# EAGLE design Schmetic (EAGLE 9.0.1)
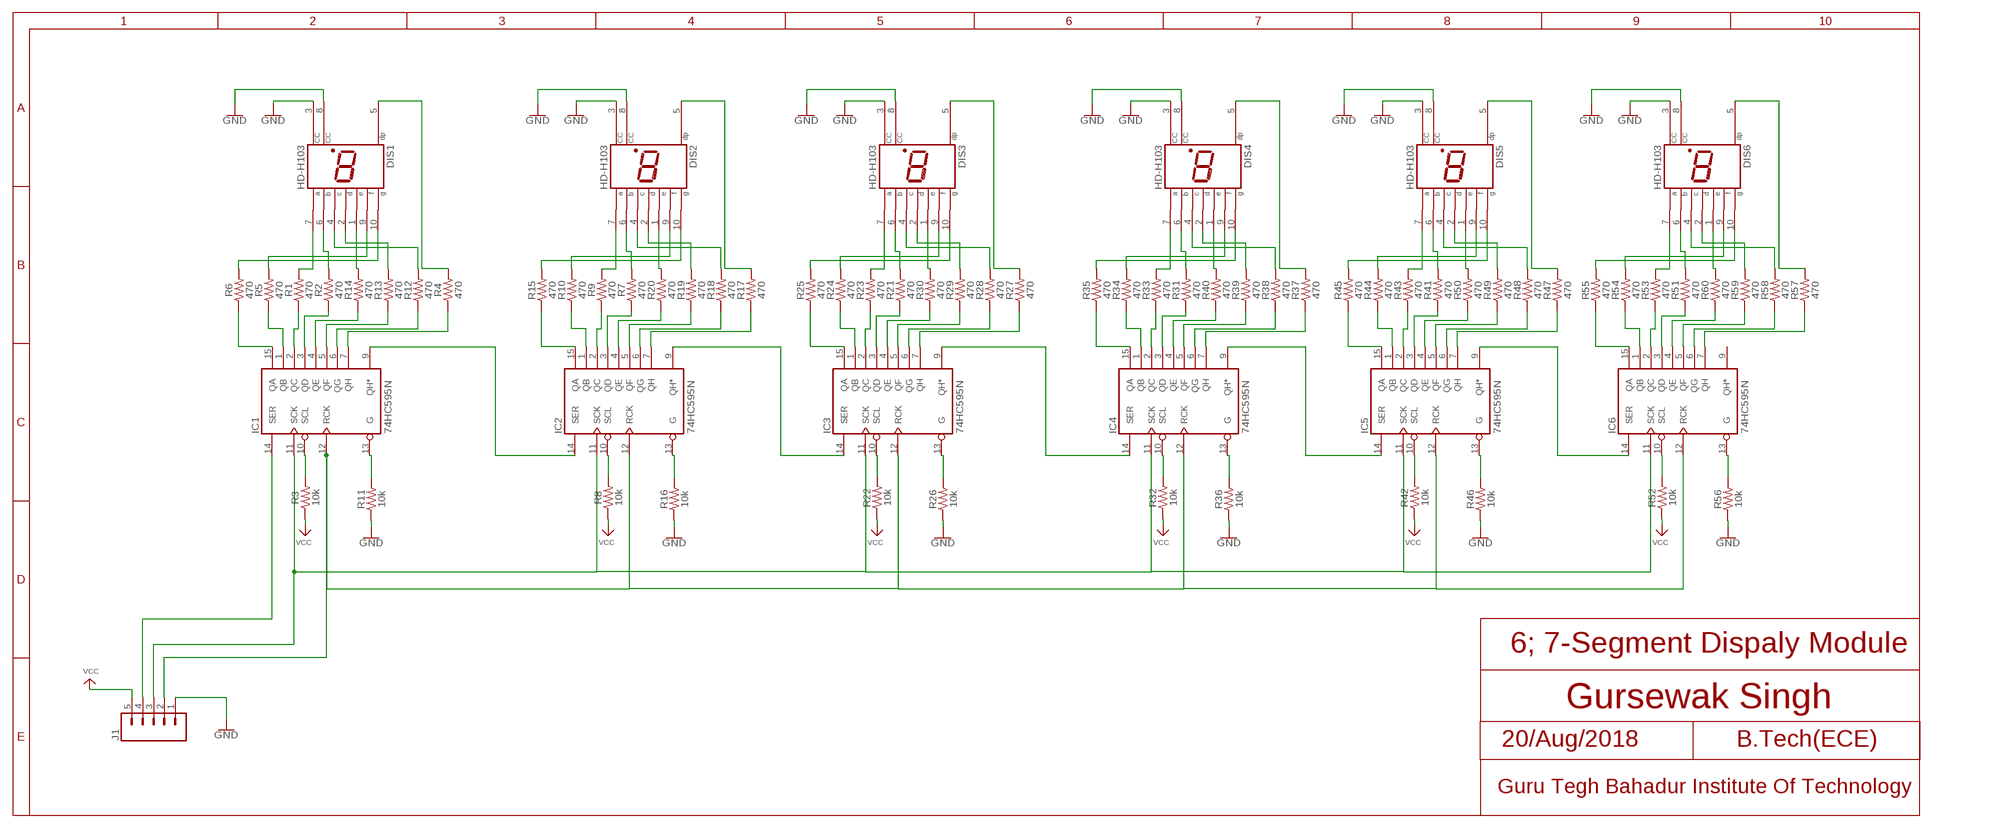
[diagram p0: schematic, sheet 1]

## Parts
DIS1  HD-H103  [HDSP-M]
DIS2  HD-H103  [HDSP-M]
DIS3  HD-H103  [HDSP-M]
DIS4  HD-H103  [HDSP-M]
DIS5  HD-H103  [HDSP-M]
DIS6  HD-H103  [HDSP-M]
IC1  74HC595N  [DIL16]
IC2  74HC595N  [DIL16]
IC3  74HC595N  [DIL16]
IC4  74HC595N  [DIL16]
IC5  74HC595N  [DIL16]
IC6  74HC595N  [DIL16]
J1  CONN_05LOCK_LONGPADS  [1X05_LOCK_LONGPADS]
R1  470  1KOHM-HORIZ-1/4W-1%  [AXIAL-0.3]
R2  470  1KOHM-HORIZ-1/4W-1%  [AXIAL-0.3]
R3  10k  1KOHM-HORIZ-1/4W-1%  [AXIAL-0.3]
R4  470  1KOHM-HORIZ-1/4W-1%  [AXIAL-0.3]
R5  470  1KOHM-HORIZ-1/4W-1%  [AXIAL-0.3]
R6  470  1KOHM-HORIZ-1/4W-1%  [AXIAL-0.3]
R7  470  1KOHM-HORIZ-1/4W-1%  [AXIAL-0.3]
R8  10k  1KOHM-HORIZ-1/4W-1%  [AXIAL-0.3]
R9  470  1KOHM-HORIZ-1/4W-1%  [AXIAL-0.3]
R10  470  1KOHM-HORIZ-1/4W-1%  [AXIAL-0.3]
R11  10k  1KOHM-HORIZ-1/4W-1%  [AXIAL-0.3]
R12  470  1KOHM-HORIZ-1/4W-1%  [AXIAL-0.3]
R13  470  1KOHM-HORIZ-1/4W-1%  [AXIAL-0.3]
R14  470  1KOHM-HORIZ-1/4W-1%  [AXIAL-0.3]
R15  470  1KOHM-HORIZ-1/4W-1%  [AXIAL-0.3]
R16  10k  1KOHM-HORIZ-1/4W-1%  [AXIAL-0.3]
R17  470  1KOHM-HORIZ-1/4W-1%  [AXIAL-0.3]
R18  470  1KOHM-HORIZ-1/4W-1%  [AXIAL-0.3]
R19  470  1KOHM-HORIZ-1/4W-1%  [AXIAL-0.3]
R20  470  1KOHM-HORIZ-1/4W-1%  [AXIAL-0.3]
R21  470  1KOHM-HORIZ-1/4W-1%  [AXIAL-0.3]
R22  10k  1KOHM-HORIZ-1/4W-1%  [AXIAL-0.3]
R23  470  1KOHM-HORIZ-1/4W-1%  [AXIAL-0.3]
R24  470  1KOHM-HORIZ-1/4W-1%  [AXIAL-0.3]
R25  470  1KOHM-HORIZ-1/4W-1%  [AXIAL-0.3]
R26  10k  1KOHM-HORIZ-1/4W-1%  [AXIAL-0.3]
R27  470  1KOHM-HORIZ-1/4W-1%  [AXIAL-0.3]
R28  470  1KOHM-HORIZ-1/4W-1%  [AXIAL-0.3]
R29  470  1KOHM-HORIZ-1/4W-1%  [AXIAL-0.3]
R30  470  1KOHM-HORIZ-1/4W-1%  [AXIAL-0.3]
R31  470  1KOHM-HORIZ-1/4W-1%  [AXIAL-0.3]
R32  10k  1KOHM-HORIZ-1/4W-1%  [AXIAL-0.3]
R33  470  1KOHM-HORIZ-1/4W-1%  [AXIAL-0.3]
R34  470  1KOHM-HORIZ-1/4W-1%  [AXIAL-0.3]
R35  470  1KOHM-HORIZ-1/4W-1%  [AXIAL-0.3]
R36  10k  1KOHM-HORIZ-1/4W-1%  [AXIAL-0.3]
R37  470  1KOHM-HORIZ-1/4W-1%  [AXIAL-0.3]
R38  470  1KOHM-HORIZ-1/4W-1%  [AXIAL-0.3]
R39  470  1KOHM-HORIZ-1/4W-1%  [AXIAL-0.3]
R40  470  1KOHM-HORIZ-1/4W-1%  [AXIAL-0.3]
R41  470  1KOHM-HORIZ-1/4W-1%  [AXIAL-0.3]
R42  10k  1KOHM-HORIZ-1/4W-1%  [AXIAL-0.3]
R43  470  1KOHM-HORIZ-1/4W-1%  [AXIAL-0.3]
R44  470  1KOHM-HORIZ-1/4W-1%  [AXIAL-0.3]
R45  470  1KOHM-HORIZ-1/4W-1%  [AXIAL-0.3]
R46  10k  1KOHM-HORIZ-1/4W-1%  [AXIAL-0.3]
R47  470  1KOHM-HORIZ-1/4W-1%  [AXIAL-0.3]
R48  470  1KOHM-HORIZ-1/4W-1%  [AXIAL-0.3]
R49  470  1KOHM-HORIZ-1/4W-1%  [AXIAL-0.3]
R50  470  1KOHM-HORIZ-1/4W-1%  [AXIAL-0.3]
R51  470  1KOHM-HORIZ-1/4W-1%  [AXIAL-0.3]
R52  10k  1KOHM-HORIZ-1/4W-1%  [AXIAL-0.3]
R53  470  1KOHM-HORIZ-1/4W-1%  [AXIAL-0.3]
R54  470  1KOHM-HORIZ-1/4W-1%  [AXIAL-0.3]
R55  470  1KOHM-HORIZ-1/4W-1%  [AXIAL-0.3]
R56  10k  1KOHM-HORIZ-1/4W-1%  [AXIAL-0.3]
R57  470  1KOHM-HORIZ-1/4W-1%  [AXIAL-0.3]
R58  470  1KOHM-HORIZ-1/4W-1%  [AXIAL-0.3]
R59  470  1KOHM-HORIZ-1/4W-1%  [AXIAL-0.3]
R60  470  1KOHM-HORIZ-1/4W-1%  [AXIAL-0.3]

## Nets
GND: DIS1.3(CC) DIS1.8(CC) DIS2.3(CC) DIS2.8(CC) DIS3.3(CC) DIS3.8(CC) DIS4.3(CC) DIS4.8(CC) DIS5.3(CC) DIS5.8(CC) DIS6.3(CC) DIS6.8(CC) J1.1 R11.P$1 R16.P$1 R26.P$1 R36.P$1 R46.P$1 R56.P$1
N$1: IC1.15(QA) R6.P$1
N$2: IC1.1(QB) R5.P$1
N$3: IC1.2(QC) R1.P$1
N$4: IC1.3(QD) R2.P$1
N$5: IC1.4(QE) R14.P$1
N$6: IC1.5(QF) R13.P$1
N$7: IC1.6(QG) R12.P$1
N$8: IC1.7(QH) R4.P$1
N$9: DIS1.10(G) R6.P$2
N$10: DIS1.9(F) R5.P$2
N$11: DIS1.7(A) R1.P$2
N$12: DIS1.6(B) R2.P$2
N$13: DIS1.1(E) R14.P$2
N$14: DIS1.2(D) R13.P$2
N$15: DIS1.4(C) R12.P$2
N$16: DIS1.5(DP) R4.P$2
N$17: IC2.15(QA) R15.P$1
N$18: IC1.10(SCL) R3.P$2
N$19: IC1.13(G) R11.P$2
N$20: IC2.1(QB) R10.P$1
N$21: IC2.2(QC) R9.P$1
N$22: IC2.3(QD) R7.P$1
N$23: IC2.4(QE) R20.P$1
N$24: IC2.5(QF) R19.P$1
N$25: IC2.6(QG) R18.P$1
N$26: IC2.7(QH) R17.P$1
N$27: DIS2.10(G) R15.P$2
N$28: DIS2.9(F) R10.P$2
N$29: DIS2.7(A) R9.P$2
N$30: DIS2.6(B) R7.P$2
N$31: DIS2.1(E) R20.P$2
N$32: DIS2.2(D) R19.P$2
N$33: DIS2.4(C) R18.P$2
N$34: DIS2.5(DP) R17.P$2
N$35: IC2.10(SCL) R8.P$2
N$36: IC2.13(G) R16.P$2
N$37: IC3.15(QA) R25.P$1
N$38: IC3.1(QB) R24.P$1
N$39: IC3.2(QC) R23.P$1
N$40: IC3.3(QD) R21.P$1
N$41: IC3.4(QE) R30.P$1
N$42: IC3.5(QF) R29.P$1
N$43: IC3.6(QG) R28.P$1
N$44: IC3.7(QH) R27.P$1
N$45: DIS3.10(G) R25.P$2
N$46: DIS3.9(F) R24.P$2
N$47: DIS3.7(A) R23.P$2
N$48: DIS3.6(B) R21.P$2
N$49: DIS3.1(E) R30.P$2
N$50: DIS3.2(D) R29.P$2
N$51: DIS3.4(C) R28.P$2
N$52: DIS3.5(DP) R27.P$2
N$53: IC3.10(SCL) R22.P$2
N$54: IC3.13(G) R26.P$2
N$55: IC4.15(QA) R35.P$1
N$56: IC4.1(QB) R34.P$1
N$57: IC4.2(QC) R33.P$1
N$58: IC4.3(QD) R31.P$1
N$59: IC4.4(QE) R40.P$1
N$60: IC4.5(QF) R39.P$1
N$61: IC4.6(QG) R38.P$1
N$62: IC4.7(QH) R37.P$1
N$63: DIS4.10(G) R35.P$2
N$64: DIS4.9(F) R34.P$2
N$65: DIS4.7(A) R33.P$2
N$66: DIS4.6(B) R31.P$2
N$67: DIS4.1(E) R40.P$2
N$68: DIS4.2(D) R39.P$2
N$69: DIS4.4(C) R38.P$2
N$70: DIS4.5(DP) R37.P$2
N$71: IC4.10(SCL) R32.P$2
N$72: IC4.13(G) R36.P$2
N$73: IC5.15(QA) R45.P$1
N$74: IC5.1(QB) R44.P$1
N$75: IC5.2(QC) R43.P$1
N$76: IC5.3(QD) R41.P$1
N$77: IC5.4(QE) R50.P$1
N$78: IC5.5(QF) R49.P$1
N$79: IC5.6(QG) R48.P$1
N$80: IC5.7(QH) R47.P$1
N$81: DIS5.10(G) R45.P$2
N$82: DIS5.9(F) R44.P$2
N$83: DIS5.7(A) R43.P$2
N$84: DIS5.6(B) R41.P$2
N$85: DIS5.1(E) R50.P$2
N$86: DIS5.2(D) R49.P$2
N$87: DIS5.4(C) R48.P$2
N$88: DIS5.5(DP) R47.P$2
N$89: IC5.10(SCL) R42.P$2
N$90: IC5.13(G) R46.P$2
N$91: IC6.15(QA) R55.P$1
N$92: IC6.1(QB) R54.P$1
N$93: IC6.2(QC) R53.P$1
N$94: IC6.3(QD) R51.P$1
N$95: IC6.4(QE) R60.P$1
N$96: IC6.5(QF) R59.P$1
N$97: IC6.6(QG) R58.P$1
N$98: IC6.7(QH) R57.P$1
N$99: DIS6.10(G) R55.P$2
N$100: DIS6.9(F) R54.P$2
N$101: DIS6.7(A) R53.P$2
N$102: DIS6.6(B) R51.P$2
N$103: DIS6.1(E) R60.P$2
N$104: DIS6.2(D) R59.P$2
N$105: DIS6.4(C) R58.P$2
N$106: DIS6.5(DP) R57.P$2
N$107: IC6.10(SCL) R52.P$2
N$108: IC6.13(G) R56.P$2
N$109: IC1.9(QH*) IC2.14(SER)
N$110: IC2.9(QH*) IC3.14(SER)
N$111: IC3.9(QH*) IC4.14(SER)
N$112: IC4.9(QH*) IC5.14(SER)
N$113: IC5.9(QH*) IC6.14(SER)
N$114: IC1.11(SCK) IC2.11(SCK) IC3.11(SCK) IC4.11(SCK) IC5.11(SCK) IC6.11(SCK) J1.3
N$115: IC1.12(RCK) IC2.12(RCK) IC3.12(RCK) IC4.12(RCK) IC5.12(RCK) IC6.12(RCK) J1.2
N$116: IC1.14(SER) J1.4
VCC: J1.5 R3.P$1 R8.P$1 R22.P$1 R32.P$1 R42.P$1 R52.P$1
Unconnected: IC6.9(QH*)

## Notes on the sheet
- 6; 7-Segment Dispaly Module
- Gursewak Singh
- 20/Aug/2018 | B.Tech(ECE)
- Guru Tegh Bahadur Institute Of Technology

## Power pins joined to a net without a drawn wire
GND: IC1.8(GND) IC2.8(GND) IC3.8(GND) IC4.8(GND) IC5.8(GND) IC6.8(GND)
VCC: IC1.16(VCC) IC2.16(VCC) IC3.16(VCC) IC4.16(VCC) IC5.16(VCC) IC6.16(VCC)

## Library data of the parts
DIS1-DIS6 = display-hp:HD-H103: LED DISPLAY 1-character 7 segment, decimal point right; OC_FARNELL: unknown; OC_NEWARK: unknown
IC1-IC6 = 74xx-eu:74*595: 8-bit SHIFT REGISTER, output latch
J1 = SparkFun-Connectors:CONN_05: Multi connection point. Often used as Generic Header-pin footprint for 0.1 inch spaced/style header connections On any of the 0.1 inch spaced packages, you can populate with these: Break Away Headers - Straight <https://www.sparkfun.com/products/116> (PRT-00116) Break Away Male Headers - Right Angle <https://www.sparkfun.com/products/553> (PRT-00553) Female Headers <https://www.sparkfun.com/products/115> (PRT-00115) Break Away Headers - Machine Pin <https://www.sparkfun.com/products/117> (PRT-00117) Break Away Female Headers - Swiss Machine Pin <https://www.sparkfun.com/products/743> (PRT-00743) For SCREWTERMINALS and SPRING TERMINALS visit here: Screw Terimnals on SparkFun.com <https://www.sparkfun.com/search/results?term=Screw+Terminals> (5mm/3.5mm/2.54mm spacing) This device is also useful as a general connection point to wire up your design to another part of your project. Our various solder wires solder well into these plated through hole pads. Hook-Up Wire - Assortment (Stranded, 22 AWG) <https://www.sparkfun.com/products/11375> (PRT-11375) Hook-Up Wire - Assortment (Solid Core, 22 AWG) <https://www.sparkfun.com/products/11367> (PRT-11367) View the entire wire category on our website here <https://www.sparkfun.com/categories/141> Special notes: Molex polarized connector foot print use with SKU : PRT-08231 with associated crimp pins and housings. 1MM SMD Version SKU: PRT-10208
R1-R60 = SparkFun-Resistors:1KOHM: 1kΩ resistor A resistor is a passive two-terminal electrical component that implements electrical resistance as a circuit element. Resistors act to reduce current flow, and, at the same time, act to lower voltage levels within circuits. - Wikipedia; PROD_ID: RES-12182; VALUE: 1k

## Board
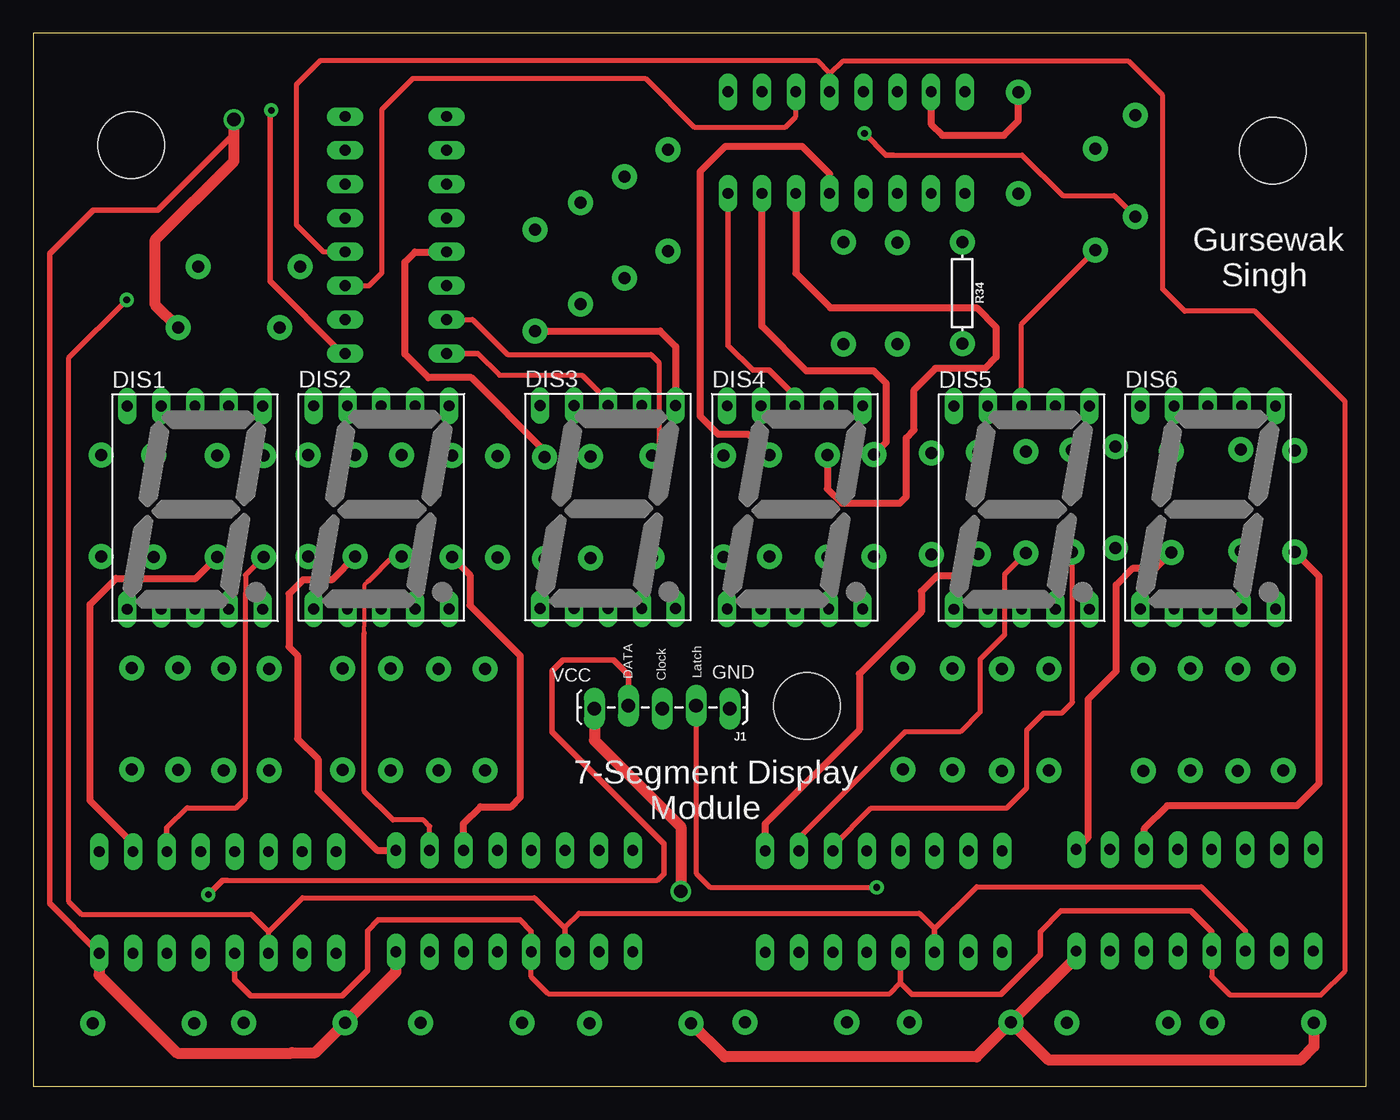
[diagram p1: board, top side]
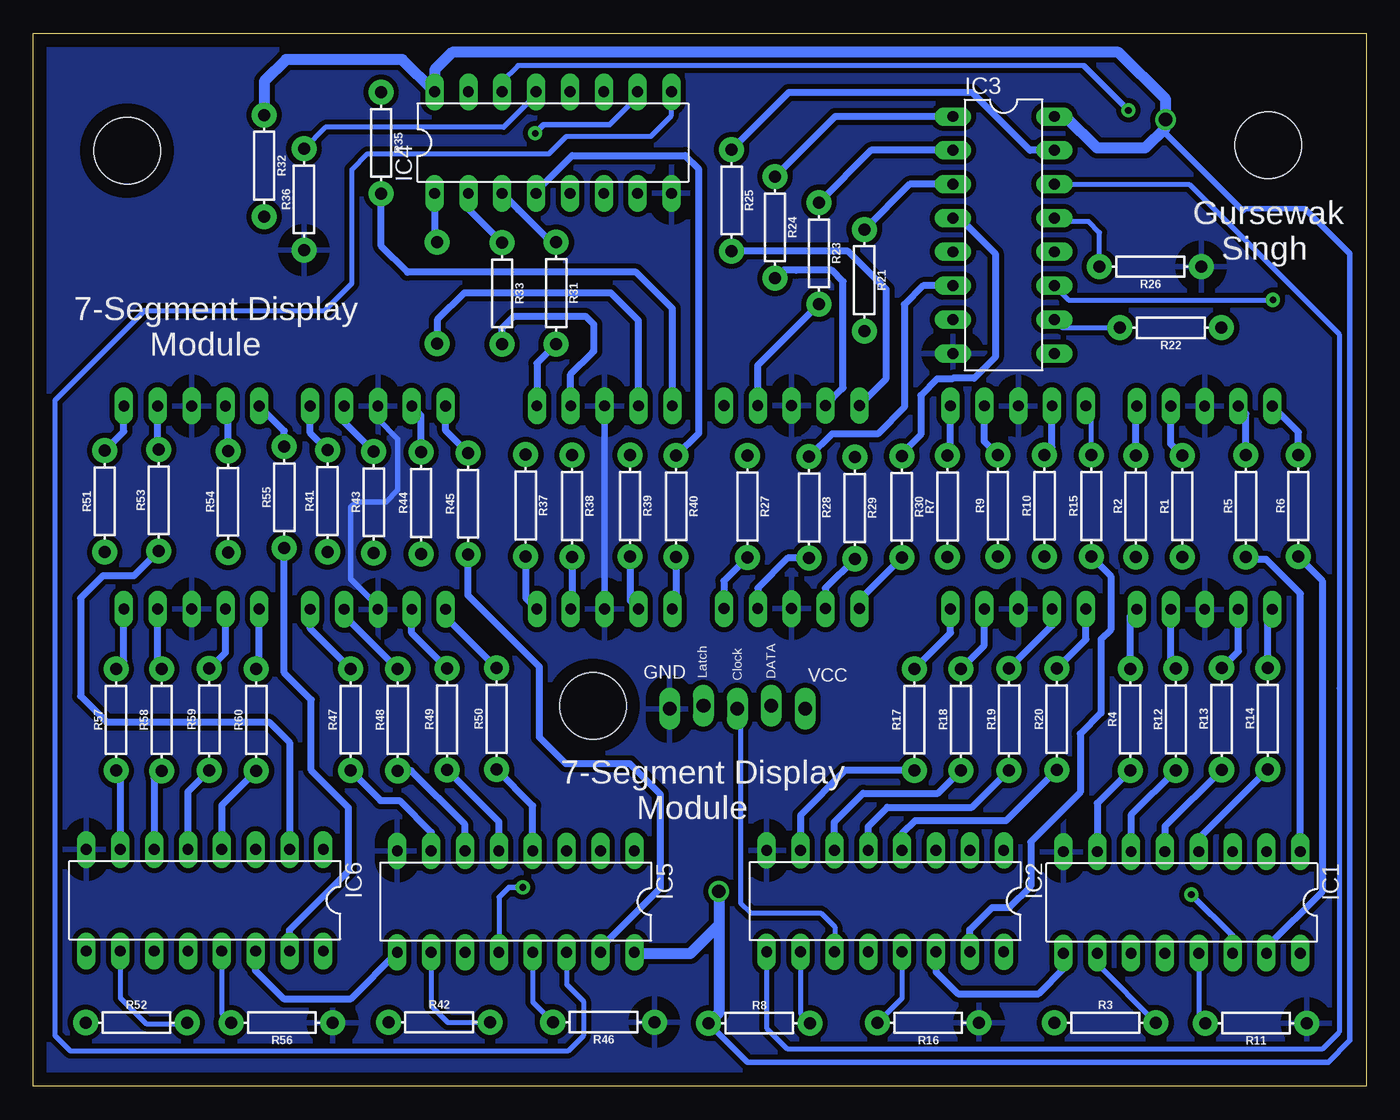
[diagram p2: board, bottom side, seen from below]

Size 100 x 79 mm. Coordinates in mm from the lower left corner, seen from the top.
Outline: 0,0 100,0 100,79 0,79 0,0
Copper layers (1*16): Top 0.035mm / dielectric 1.5mm / Bottom 0.035mm
Design rules "default *": minimum track width 6mil, minimum drill 0.35mm, track to track 15mil, track to pad 15mil, pad to pad 15mil, via to via 15mil, smd to smd 15mil, copper to edge 40mil, drill to drill 8mil, minimum pad ring 11mil, minimum via ring 11mil, stop-mask expansion 4mil, vias tented up to drill 1mm, thermal gap 1mm
Holes 5 mm at 92.97,70.2 7.35,70.6 58.02,28.55

### Footprints (pad centres in the part's own frame; a part is rotated, then mirrored left to right if it is on the bottom)
HDSP-M = drill 0.813 long: 1 -5.08,-7.62; 2 -2.54,-7.62; 3 0,-7.62; 4 2.54,-7.62; 5 5.08,-7.62; 6 5.08,7.62; 7 2.54,7.62; 8 0,7.62; 9 -2.54,7.62; 10 -5.08,7.62
DIL16 = drill 0.813 long: 1 -8.89,-3.81; 2 -6.35,-3.81; 3 -3.81,-3.81; 4 -1.27,-3.81; 5 1.27,-3.81; 6 3.81,-3.81; 7 6.35,-3.81; 8 8.89,-3.81; 9 8.89,3.81; 10 6.35,3.81; 11 3.81,3.81; 12 1.27,3.81; 13 -1.27,3.81; 14 -3.81,3.81; 15 -6.35,3.81; 16 -8.89,3.81
1X05_LOCK_LONGPADS = drill 1.016 long: 1 0,0; 2 2.54,-0.254; 3 5.08,0; 4 7.62,-0.254; 5 10.16,0
AXIAL-0.3 = drill 0.9 pad 1.88: P$1 -3.81,0; P$2 3.81,0

### Placement (x,y rotation side)
DIS1  12.12,43.41 0 top
DIS2  26.11,43.43 0 top
DIS3  43.11,43.45 0 top
DIS4  57.14,43.43 0 top
DIS5  74.14,43.41 0 top
DIS6  88.12,43.42 0 top
IC1  13.83,13.79 180 bottom
IC2  36.09,13.89 180 bottom
IC3  27.2,63.87 270 bottom
IC4  61.01,70.8 0 bottom
IC5  63.8,13.85 180 bottom
IC6  87.13,13.95 180 bottom
J1  52.26,28.31 180 top
R1  13.79,43.51 90 bottom
R2  17.29,43.52 90 bottom
R3  19.57,4.76 0 bottom
R4  17.71,27.52 90 bottom
R5  9.02,43.53 90 bottom
R6  5.09,43.54 90 bottom
R7  31.41,43.5 90 bottom
R8  45.53,4.73 0 bottom
R9  27.64,43.55 90 bottom
R10  24.14,43.55 90 bottom
R11  8.27,4.73 180 bottom
R12  14.28,27.52 90 bottom
R13  10.85,27.56 90 bottom
R14  7.38,27.58 90 bottom
R15  20.62,43.54 90 bottom
R16  32.85,4.75 180 bottom
R17  33.9,27.49 90 bottom
R18  30.4,27.51 90 bottom
R19  26.79,27.52 90 bottom
R20  23.21,27.53 90 bottom
R21  37.66,60.47 270 bottom
R22  14.66,56.91 180 bottom
R23  41.06,62.5 270 bottom
R24  44.36,64.43 270 bottom
R25  47.61,66.47 270 bottom
R26  16.2,61.5 180 bottom
R27  46.42,43.49 270 bottom
R28  41.8,43.42 270 bottom
R29  38.37,43.38 270 bottom
R30  34.84,43.47 270 bottom
R31  60.77,59.5 270 bottom
R32  82.68,69.06 270 bottom
R33  64.83,59.48 270 bottom
R34  69.69,59.52 270 top
R35  73.91,70.78 270 bottom
R36  79.69,66.54 90 bottom
R37  63.05,43.57 270 bottom
R38  59.58,43.53 270 bottom
R39  55.23,43.54 270 bottom
R40  51.77,43.51 270 bottom
R41  77.94,43.91 90 bottom
R42  69.55,4.79 0 bottom
R43  74.46,43.81 90 bottom
R44  70.91,43.76 90 bottom
R45  67.39,43.7 90 bottom
R46  57.22,4.81 180 bottom
R47  76.2,27.49 90 bottom
R48  72.65,27.48 90 bottom
R49  68.95,27.52 90 bottom
R50  65.25,27.56 90 bottom
R51  94.65,43.88 90 bottom
R52  92.27,4.77 0 bottom
R53  90.6,43.96 90 bottom
R54  85.39,43.84 90 bottom
R55  81.17,44.19 90 bottom
R56  81.35,4.77 180 bottom
R57  93.79,27.49 90 bottom
R58  90.36,27.48 90 bottom
R59  86.79,27.52 90 bottom
R60  83.27,27.48 90 bottom

### Tracks (layer width: path | path; a pad name or v marks a point on that pad's centre or on a via)
GND
  Top 0.381: 33.34,54.98 34.98,53.35 41.17,53.35 43.11,51.42 DIS3.8 | DIS5.8 74.14,57.18 R36.P$1
  Top 0.406: IC4.8 52.12,55.58 53.98,53.72 55.18,53.72 57.14,51.76 DIS4.8 | 33.34,54.98 IC3.8
  Bottom 0.406: DIS5.8 74.14,50.05 72.67,48.58 72.67,44.73 73.55,43.85 75.8,43.85 76.2,43.45 76.2,38.06 74.14,36.01 DIS5.3
  Bottom 0.5: DIS4.8 DIS4.3
  pour Bottom: 0,79 100,79 100,72 100,0 34,0 0,0
N$1
  Bottom 0.381: 7.48,10.03 IC1.15
  Bottom 0.508: R6.P$1 3.3,37.94 3.3,14.6 7.48,10.42 7.48,10.03
N$2
  Bottom 0.381: 8.82,39.52 R5.P$1
  Bottom 0.508: IC1.1 4.94,36.97 7.5,39.52 8.82,39.52
N$3
  Top 0.508: IC1.2 7.48,18.2 4.25,21.42 4.25,36.15 6.2,38.1 12.2,38.1 R1.P$1
N$4
  Top 0.33: 15.93,33.85 15.93,33.1
  Top 0.381: 10.02,19.37 11.55,20.9 15.22,20.9 15.93,21.6 15.93,33.1 15.93,33.85 15.93,37 15.93,38.34 R2.P$1
  Top 0.406: 10.02,19.37 IC1.3
N$5
  Bottom 0.508: R14.P$1 12.56,18.58 IC1.4
N$6
  Bottom 0.508: R13.P$1 15.1,19.5 IC1.5
N$7
  Bottom 0.508: R12.P$1 17.64,20.34 IC1.6
N$8
  Bottom 0.508: R4.P$1 20.18,21.23 IC1.7
N$9
  Bottom 0.508: R6.P$2 5.09,49.07 DIS1.10
N$10
  Bottom 0.508: R5.P$2 9.02,50.45 DIS1.9
N$11
  Bottom 0.508: R1.P$2 14.66,48.19 DIS1.7
N$12
  Bottom 0.381: 17.29,50.94 DIS1.6
  Bottom 0.508: R2.P$2 17.29,50.94
N$13
  Bottom 0.508: R14.P$2 7.38,35.45 DIS1.1
N$14
  Bottom 0.508: R13.P$2 9.59,32.63 DIS1.2
N$15
  Bottom 0.508: R12.P$2 14.66,31.72 DIS1.4
N$16
  Bottom 0.508: R4.P$2 17.71,35.28 DIS1.5
N$17
  Bottom 0.508: R15.P$1 19.18,38.28 19.18,34.25 19.9,33.52 19.9,28 21.45,26.45 21.45,22.05 25.18,18.33 25.18,15 26.76,13.41 28.06,13.41 29.74,11.73 IC2.15
N$18
  Bottom 0.381: IC1.10 20.18,9.18 R3.P$2
N$19
  Bottom 0.381: IC1.13 12.56,5.22 R11.P$2
N$20
  Top 0.508: R10.P$1 22.4,38 20.23,38 19.18,36.95 19.18,32.98 19.82,32.33 19.82,26.08 21.35,24.55 21.35,22.12 25.77,17.7 IC2.1
N$21
  Top 0.305: 25.11,37.89 24.82,37.6 24.82,37.07 24.83,37.06 24.83,34.55 24.82,34.55 24.82,34.08
  Top 0.33: 24.82,34 24.82,34.08
  Top 0.381: IC2.2 29.74,19.51 29.27,19.98 26.98,19.98 24.82,22.13 24.82,34 | R9.P$1 26.97,39.74 25.11,37.89
N$22
  Top 0.508: IC2.3 32.28,19.7 33.55,20.98 35.83,20.98 36.55,21.7 36.55,32.27 32.75,36.08 32.75,38.35 R7.P$1
N$23
  Bottom 0.508: R20.P$1 27.02,19.92 33.85,19.92 34.82,18.95 IC2.4
N$24
  Bottom 0.508: R19.P$1 29.57,20.92 35.92,20.92 37.36,19.49 IC2.5
N$25
  Bottom 0.508: IC2.6 39.9,19.83 37.75,21.98 32.12,21.98 R18.P$1
N$26
  Bottom 0.508: R17.P$1 39.09,23.69 42.44,20.34 IC2.7
N$27
  Bottom 0.381: R15.P$2 20.62,50.65 DIS2.10
N$28
  Bottom 0.508: R10.P$2 23.57,47.92 DIS2.9
N$29
  Bottom 0.508: R9.P$2 28.64,48.38 DIS2.7
N$30
  Bottom 0.508: R7.P$2 31.18,47.53 DIS2.6
N$31
  Bottom 0.508: R20.P$2 21.02,33.53 DIS2.1
N$32
  Bottom 0.508: R19.P$2 23.57,34.55 DIS2.2
N$33
  Bottom 0.508: R18.P$2 28.64,33.08 DIS2.4
N$34
  Bottom 0.508: R17.P$2 31.18,34.02 DIS2.5
N$35
  Bottom 0.381: IC2.10 42.44,5.45 R8.P$2
N$36
  Bottom 0.381: IC2.13 34.82,6.59 R16.P$2
N$37
  Bottom 0.508: IC3.15 25.22,70.22 29.55,74.55 43.34,74.55 R25.P$1
N$38
  Bottom 0.508: IC3.1 39.84,72.76 R24.P$1
N$39
  Bottom 0.508: IC3.2 37.15,70.22 R23.P$1
N$40
  Bottom 0.508: IC3.3 34.27,67.68 R21.P$1
N$41
  Bottom 0.508: IC3.4 30.49,65.14 27.82,62.47 27.82,54.7 29.4,53.12 31,53.12 31.07,53.06 32.19,53.06 33.42,51.83 33.42,48.9 34.84,47.48 R30.P$1
N$42
  Top 0.508: R29.P$1 38.37,47.66 32.88,53.15 29.65,53.15 27.88,54.92 27.88,61.85 28.62,62.6 IC3.5
N$43
  Bottom 0.508: IC3.6 33.24,60.06 34.65,58.65 34.65,50.95 36.65,48.95 40.08,48.95 R28.P$1
N$44
  Top 0.381: IC3.7 32.95,57.52 35.58,54.9 46.33,54.9 46.92,54.3 46.92,47.8 R27.P$1
N$45
  Bottom 0.508: DIS3.10 36,53.11 36,59.78 38.88,62.66 R25.P$2
N$46
  Bottom 0.508: DIS3.9 39.35,52.29 39.35,52.31 39.25,52.41 39.25,60.38 40.1,61.22 42.75,61.22 43.76,61.22 R24.P$2
N$47
  Bottom 0.508: DIS3.7 45.65,54.09 R23.P$2
N$48
  Top 0.508: DIS3.6 48.19,55.5 47.02,56.67 R21.P$2
N$49
  Bottom 0.508: R30.P$2 38.03,36.48 DIS3.1
N$50
  Bottom 0.381: 40.57,36 DIS3.2
  Bottom 0.508: R29.P$2 40.57,37.38 40.57,36
N$51
  Bottom 0.508: R28.P$2 43.41,39.62 45.65,37.38 DIS3.4
N$52
  Bottom 0.508: R27.P$2 48.19,37.91 DIS3.5
N$53
  Bottom 0.381: IC3.10 22.78,56.91 R22.P$2
N$54
  Bottom 0.381: R26.P$2 20,64.06 20.82,64.88 23.12,64.88 IC3.13
N$55
  Top 0.508: IC4.15 67.36,72.19 68.2,71.35 72.83,71.35 73.91,72.43 R35.P$1
N$56
  Bottom 0.508: IC4.1 69.9,63.53 R34.P$1
N$57
  Bottom 0.508: IC4.2 67.36,65.82 R33.P$1
N$58
  Bottom 0.508: IC4.3 63.6,65.77 63.6,65.76 61.16,63.31 R31.P$1
N$59
  Bottom 0.508: R40.P$1 50.08,49 50.08,68.8 51.1,69.83 59.57,69.83 62.28,67.11 IC4.4
N$60
  Top 0.508: IC4.5 59.74,68.46 57.7,70.5 51.9,70.5 50.02,68.62 50.02,50.28 51.38,48.92 53.66,48.92 R39.P$1
N$61
  Top 0.508: IC4.6 57.2,61 59.8,58.4 70.78,58.4 72.22,56.95 72.22,54.7 71.38,53.85 67.67,53.85 66.08,52.25 66.08,49.24 65.49,48.65 65.49,44.24 65,43.75 60.65,43.75 59.58,44.82 R38.P$1
N$62
  Top 0.508: IC4.7 54.66,57.02 58,53.67 63.05,53.67 64,52.72 64,48.33 R37.P$1
N$63
  Bottom 0.508: DIS4.10 52.06,58.36 54.77,61.08 71.93,61.08 73.91,63.05 R35.P$2
N$64
  Bottom 0.508: DIS4.9 54.6,57.45 56.67,59.53 67.67,59.53 69.69,57.5 R34.P$2
N$65
  Bottom 0.381: 58.05,55.05 57.95,55.15
  Bottom 0.508: DIS4.7 59.68,53.42 58.05,55.05 | 57.95,55.15 57.95,57.15 58.58,57.78 63.92,57.78 64.83,56.87 R33.P$2
N$66
  Bottom 0.508: R31.P$2 62.22,54.25 DIS4.6
N$67
  Bottom 0.508: R40.P$2 51.77,36.1 DIS4.1
N$68
  Bottom 0.508: R39.P$2 55.23,36.44 DIS4.2
N$69
  Bottom 0.381: 59.58,35.91 DIS4.4
  Bottom 0.508: R38.P$2 59.58,35.91
N$70
  Bottom 0.508: R37.P$2 63.05,36.65 DIS4.5
N$71  (via drill 0.5)
  Top 0.381: 64.53,69.88 74.17,69.88 77.22,66.83 81.11,66.83 R32.P$2
  Top 0.406: 64.53,69.88 63.98,69.88 v62.35,71.5
  Bottom 0.381: 56.76,72.14 54.66,74.23 IC4.10
  Bottom 0.406: 56.76,72.14 61.72,72.14 v62.35,71.5
N$72
  Bottom 0.381: R36.P$2 78.09,71.95 64.72,71.95 62.28,74.39 IC4.13
N$73
  Bottom 0.508: IC5.15 57.45,10.36 52.95,14.86 52.95,21.9 55.25,24.2 60.05,24.2 62.02,26.17 62.02,31.48 67.39,36.84 R45.P$1
N$74
  Top 0.508: R44.P$1 69.24,38.27 67.78,38.27 66.62,37.12 66.62,35.6 61.98,30.95 61.98,26.75 54.91,19.69 IC5.1
N$75
  Top 0.381: R43.P$1 72.86,38.41 72.86,33.86 71.03,32.02 71.03,28.08 69.55,26.6 65.4,26.6 57.45,18.65 IC5.2
N$76
  Top 0.381: R41.P$1 77.96,40.08 77.96,28.81 77.15,28 75.8,28 74.53,26.73 74.53,22.38 73.03,20.88 62.85,20.88 59.99,18.01 IC5.3
N$77
  Bottom 0.508: IC5.4 62.53,21.03 R50.P$1
N$78
  Bottom 0.508: IC5.5 65.07,19.84 R49.P$1
N$79
  Bottom 0.508: IC5.6 67.61,19.63 71.65,23.67 R48.P$1
N$80
  Bottom 0.508: IC5.7 70.15,19.05 72.54,21.44 73.95,21.44 R47.P$1
N$81
  Bottom 0.508: R45.P$2 69.06,49.19 DIS5.10
N$82
  Bottom 0.508: R44.P$2 70.91,50.33 DIS5.9
N$83
  Bottom 0.508: R43.P$2 76.69,49.85 DIS5.7
N$84
  Bottom 0.508: R41.P$2 79.22,49.01 DIS5.6
N$85
  Bottom 0.508: R50.P$2 69.06,35.19 DIS5.1
N$86
  Bottom 0.508: R49.P$2 71.61,33.99 DIS5.2
N$87
  Bottom 0.508: R48.P$2 76.69,35.33 DIS5.4
N$88
  Bottom 0.508: R47.P$2 79.22,34.33 DIS5.5
N$89
  Bottom 0.381: IC5.10 70.15,6.02 68.92,4.79 R42.P$2
N$90
  Bottom 0.381: IC5.13 62.53,6.32 R46.P$2
N$91
  Bottom 0.508: IC6.15 80.78,11.72 76.35,16.15 76.35,20.9 79.15,23.7 79.15,29 81.17,31.02 R55.P$1
N$92
  Top 0.508: IC6.1 79.15,18.67 79.15,29.05 81.25,31.15 81.25,37.62 82.5,38.88 84.23,38.88 R54.P$1
N$93
  Bottom 0.508: R53.P$1 92.45,38.3 94.78,38.3 96.45,36.62 96.45,29.27 94.5,27.33 82.33,27.33 80.78,25.78 IC6.2
N$94
  Top 0.508: R51.P$1 96.45,38.27 96.45,22.7 94.8,21.05 85.08,21.05 83.32,19.3 IC6.3
N$95
  Bottom 0.508: R60.P$1 85.86,21.08 IC6.4
N$96
  Bottom 0.508: R59.P$1 88.4,22.1 IC6.5
N$97
  Bottom 0.508: R58.P$1 90.94,23.09 IC6.6
N$98
  Bottom 0.508: R57.P$1 93.48,23.37 IC6.7
N$99
  Bottom 0.508: R55.P$2 81.17,49.16 DIS6.10
N$100
  Bottom 0.508: R54.P$2 85.39,50.84 DIS6.9
N$101
  Bottom 0.381: 90.67,51 DIS6.7
  Bottom 0.508: R53.P$2 90.67,47.84 90.67,51
N$102
  Bottom 0.381: 93.2,51 DIS6.6
  Bottom 0.508: R51.P$2 93.2,49.14 93.2,51
N$103
  Bottom 0.508: R60.P$2 83.05,31.52 DIS6.1
N$104
  Bottom 0.508: R59.P$2 85.58,32.53 DIS6.2
N$105
  Bottom 0.508: R58.P$2 90.67,31.59 DIS6.4
N$106
  Bottom 0.508: R57.P$2 93.2,31.88 DIS6.5
N$107
  Bottom 0.381: IC6.10 93.48,6.63 91.55,4.7 88.53,4.7 R52.P$2
N$108
  Bottom 0.381: IC6.13 85.86,5.46 R56.P$2
N$109
  Bottom 0.508: IC1.9 22.72,8.8 24.57,6.95 30.65,6.95 32.28,8.58 IC2.14
N$110
  Bottom 0.381: IC2.9 44.98,4.36 43.45,2.82 3.25,2.82 2.02,4.05 2.02,29.85 2.02,56.42 13.28,67.68 IC3.14
N$111  (via drill 0.5)
  Top 0.381: IC3.9 23.16,54.98
  Top 0.406: 23.16,54.98 17.75,60.39 17.75,73.12 v17.85,73.22
  Bottom 0.381: 21.2,76.58 63.65,76.58 64.82,75.41 IC4.14
  Bottom 0.406: v17.85,73.22 21.2,76.58
N$112
  Bottom 0.381: IC5.14 59.99,7.64 58.73,6.38 58.73,3.8 59.9,2.62 97.2,2.62 98.38,3.8 98.38,51.47 91.65,58.2 78.15,58.2 76.1,60.25 76.1,68.78 74.92,69.95 61.33,69.95 60,71.28 53.67,71.28 52.12,72.83 IC4.9
N$113
  Bottom 0.508: IC5.9 76.2,6.52 81.17,6.52 83.32,8.67 IC6.14
N$114  (via drill 0.5)
  Top 0.381: IC1.11 17.64,11.59 | 17.64,11.59 20.2,14.15 37.6,14.15 39.9,11.85 IC2.11 39.9,11.95 40.92,12.98 66.47,12.98 67.61,11.84 IC5.11 67.61,11.81 70.78,14.98 87.62,14.98 90.94,11.66 IC6.11 | IC3.11 25.18,60.06 26.15,61.03 26.15,73.3 28.48,75.62 45.92,75.62 49.58,71.97 56.42,71.97 57.2,72.75 IC4.11 | v7,59 2.62,54.62 2.62,13.88 3.6,12.9 16.33,12.9 17.64,11.59
  Bottom 0.381: IC3.11 22.33,59 v7,59 | IC2.11 39.88,10.11 39.88,11.95 40.92,13 46.17,13 46.93,13.75 46.93,28.06 J1.3
N$115  (via drill 0.5)
  Top 0.381: 65.92,6.9 65.07,7.75 IC5.12 65.07,7.77 64.25,6.95 38.62,6.95 37.36,8.21 37.36,9.77 IC2.12 | IC3.12 21.77,62.6 19.75,64.62 19.75,75.17 21.55,76.97 58.77,76.97 59.74,76.01 IC4.12 59.74,75.92 60.73,76.9 82.17,76.9 84.72,74.35 84.72,59.8 86.38,58.15 91.65,58.15 98.42,51.38 98.42,8.68 96.6,6.85 89.78,6.85 88.4,8.23 IC6.12 | J1.2 49.72,15.98 50.77,14.93 v63.27,14.93
  Top 0.406: 65.92,6.9 72.6,6.9 75.55,9.85 75.55,11.6 77.1,13.15 86.85,13.15 88.42,11.57 88.42,10.61 88.4,10.59 IC6.12 | IC1.12 15.1,7.98 16.3,6.77 23.15,6.77 25.07,8.7 25.07,11.68 25.88,12.48 36.5,12.48 37.36,11.61 37.36,9.77
  Bottom 0.381: IC5.12 65.07,14.18 64.33,14.93
  Bottom 0.406: 64.33,14.93 v63.27,14.93
N$116  (via drill 0.5)
  Top 0.381: 47.3,15.93 46.83,15.45 14.55,15.45
  Top 0.406: 47.3,15.93 47.3,18.2 38.92,26.58 38.92,31.17 39.73,31.98 43.52,31.98 44.64,30.86 J1.4 | v13.12,14.38 14.2,15.45 14.55,15.45
  Bottom 0.406: v13.12,14.38 10.02,11.27 IC1.14
VCC  (via drill 1)
  Top 0.406: IC1.16 1.22,13.7 1.22,62.47 4.49,65.75 9.32,65.75 15.05,71.47 v15.05,72.53
  Top 0.813: J1.5 42.1,25.95 48.58,19.48 v48.58,14.62 | IC1.16 4.94,8.34 10.8,2.48 19.35,2.48 19.4,2.52 21.15,2.52 R3.P$1 27.2,8.57 IC2.16 | R52.P$1 96.08,2.98 95.05,1.95 76.2,1.95 R42.P$1 | R42.P$1 70.77,2.2 51.88,2.2 R8.P$1 | R42.P$1 78.24,9.67 IC6.16 | R22.P$1 9.15,58.61 9.15,63.53 15.05,69.42 v15.05,72.53
  Bottom 0.406: R8.P$1 46.41,1.8 2.86,1.8 1.22,3.44 1.22,62.47 4.6,65.85 9.12,65.85 9.28,65.7 15.05,71.47 v15.05,72.53
  Bottom 0.813: IC5.16 54.82,9.95 50.73,9.95 48.58,12.1 v48.58,14.62 48.58,5.5 R8.P$1 | R32.P$1 82.68,75.39 81.05,77.03 72.31,77.03 IC4.16 69.9,74.64 69.88,74.65 69.88,76.26 68.57,77.58 18.58,77.58 15.05,74.05 v15.05,72.53 15.05,71.92 16.57,70.4 20.2,70.4 22.56,72.76 IC3.16

### Text on the board
tPlace: Gursewak / Singh | GND | VCC | DATA | Latch | Clock | 7-Segment Display / Module
bPlace: Gursewak / Singh | 7-Segment Display / Module | GND | VCC | DATA | Latch | Clock | 7-Segment Display / Module